# EAGLE schematic reeeflow-v3 (EAGLE 9.3.0)
CREVISION: 1.0; DESIGNER: Rafael Silva

## Sheet 1 of 4: Main Controller
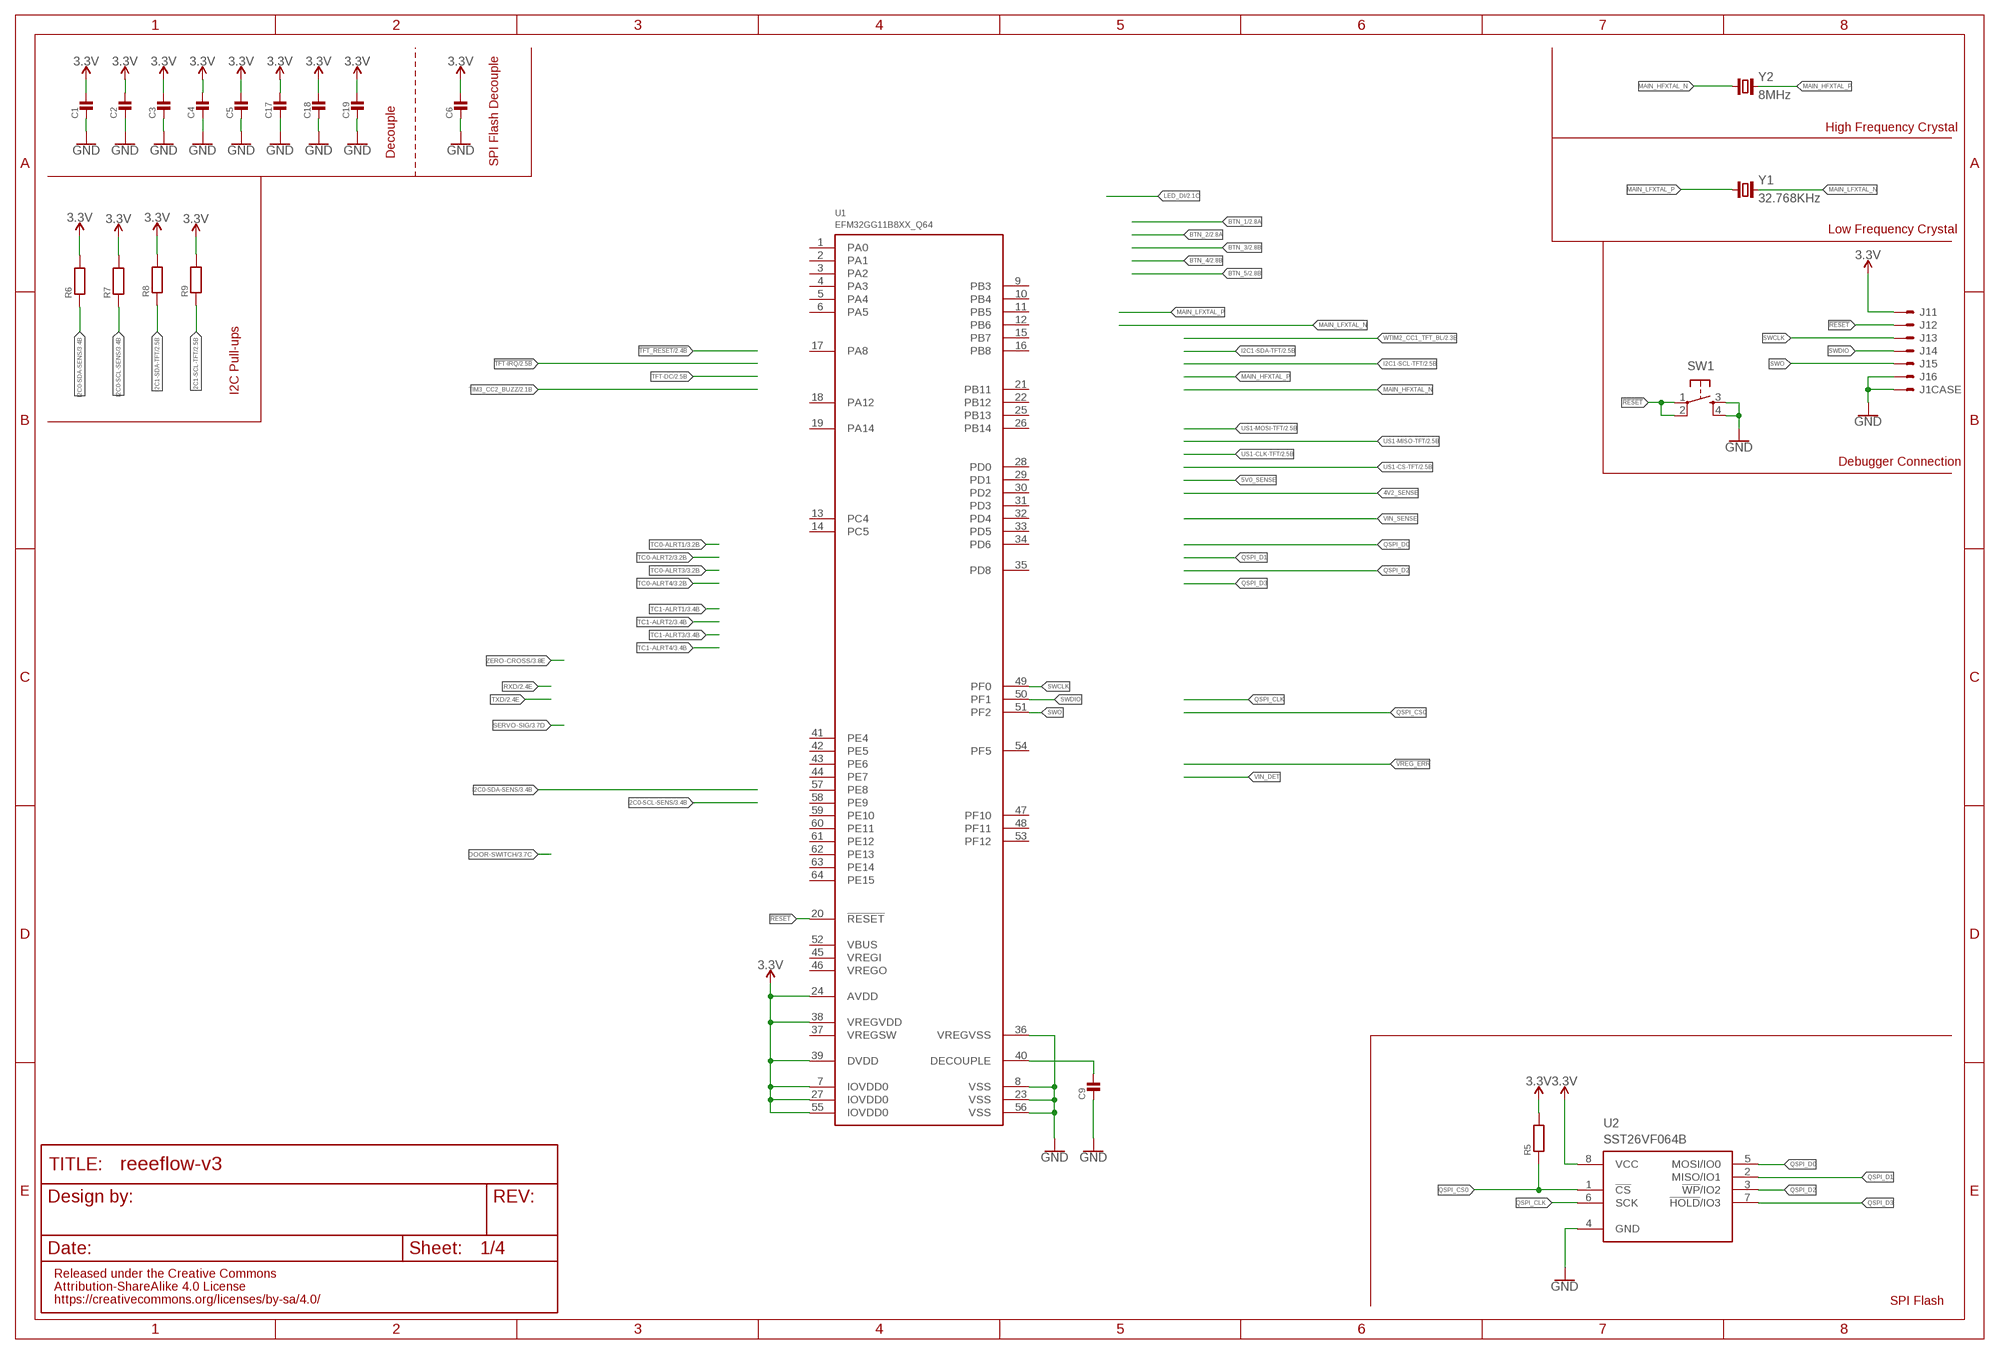
[diagram p0: schematic, sheet 1]

### Parts
C1  MLCC0603  [0603_WAVE]
C2  MLCC0603  [0603_WAVE]
C3  MLCC0603  [0603_WAVE]
C4  MLCC0603  [0603_WAVE]
C5  MLCC0603  [0603_WAVE]
C6  MLCC0603  [0603_WAVE]
C9  MLCC0603  [0603_WAVE]
C17  MLCC0603  [0603_WAVE]
C18  MLCC0603  [0603_WAVE]
C19  MLCC0603  [0603_WAVE]
J1  SH-6  [SM06B-SSR-H-TB]
R5  RESISTOR0603  [0603_WAVE]
R6  RESISTOR0603  [0603_WAVE]
R7  RESISTOR0603  [0603_WAVE]
R8  RESISTOR0603  [0603_WAVE]
R9  RESISTOR0603  [0603_WAVE]
SW1  PUSH_BUTTON  [PUSH_BUTTON]
U1  EFM32GG11B8XX_Q64  [QFP64]
U2  SST26VF064B  [WSOIC8]
Y1  32.768KHz  CRYSTALCM200S  [CM200S]
Y2  8MHz  CRYSTALNX5032GA  [2-SMD-5X3]

### Nets
3.3V: C1.P$1 C2.P$1 C3.P$1 C4.P$1 C5.P$1 C6.P$1 C17.P$1 C18.P$1 C19.P$1 J1.1 R5.P$2 R6.P$2 R7.P$2 R8.P$2 R9.P$2 U1.7(IOVDD0) U1.24(AVDD) U1.27(IOVDD0) U1.38(VREGVDD) U1.39(DVDD) U1.55(IOVDD0) U2.8(VCC) ; also sheet 2,3,4
!RESET: J1.2 SW1.1 SW1.2 U1.20(!RESET)
GND: C1.P$2 C2.P$2 C3.P$2 C4.P$2 C5.P$2 C6.P$2 C9.P$2 C17.P$2 C18.P$2 C19.P$2 J1.6 J1.FIT@1 J1.FIT@2 SW1.3 SW1.4 U1.8(VSS) U1.23(VSS) U1.36(VREGVSS) U1.56(VSS) U2.4(GND) ; also sheet 2,3,4
I2C0-SCL-SENS: R7.P$1 ; also sheet 3
I2C0-SDA-SENS: R6.P$1 ; also sheet 3
I2C1-SCL-TFT: R9.P$1 ; also sheet 2
I2C1-SDA-TFT: R8.P$1 ; also sheet 2
MAIN_HFXTAL_N: Y2.1
MAIN_HFXTAL_P: Y2.2
MAIN_LFXTAL_N: Y1.4
MAIN_LFXTAL_P: Y1.1
N$9: C9.P$1 U1.40(DECOUPLE)
QSPI_CLK: U2.6(SCK)
QSPI_CS0: R5.P$1 U2.1(!CS!)
QSPI_D0: U2.5(MOSI/IO0)
QSPI_D1: U2.2(MISO/IO1)
QSPI_D2: U2.3(!WP!/IO2)
QSPI_D3: U2.7(!HOLD!/IO3)
SWCLK: J1.3 U1.49(PF0)
SWDIO: J1.4 U1.50(PF1)
SWO: J1.5 U1.51(PF2)
Unconnected: U1.1(PA0) U1.2(PA1) U1.3(PA2) U1.4(PA3) U1.5(PA4) U1.6(PA5) U1.9(PB3) U1.10(PB4) U1.11(PB5) U1.12(PB6) U1.13(PC4) U1.14(PC5) U1.15(PB7) U1.16(PB8) U1.17(PA8) U1.18(PA12) U1.19(PA14) U1.21(PB11) U1.22(PB12) U1.25(PB13) U1.26(PB14) U1.28(PD0) U1.29(PD1) U1.30(PD2) U1.31(PD3) U1.32(PD4) U1.33(PD5) U1.34(PD6) U1.35(PD8) U1.37(VREGSW) U1.41(PE4) U1.42(PE5) U1.43(PE6) U1.44(PE7) U1.45(VREGI) U1.46(VREGO) U1.47(PF10) U1.48(PF11) U1.52(VBUS) U1.53(PF12) U1.54(PF5) U1.57(PE8) U1.58(PE9) U1.59(PE10) U1.60(PE11) U1.61(PE12) U1.62(PE13) U1.63(PE14) U1.64(PE15)

### Notes on the sheet
- High Frequency Crystal
- Decouple
- SPI Flash Decouple
- Low Frequency Crystal
- I2C Pull-ups
- Debugger Connection
- SPI Flash

## Sheet 2 of 4: User Interface
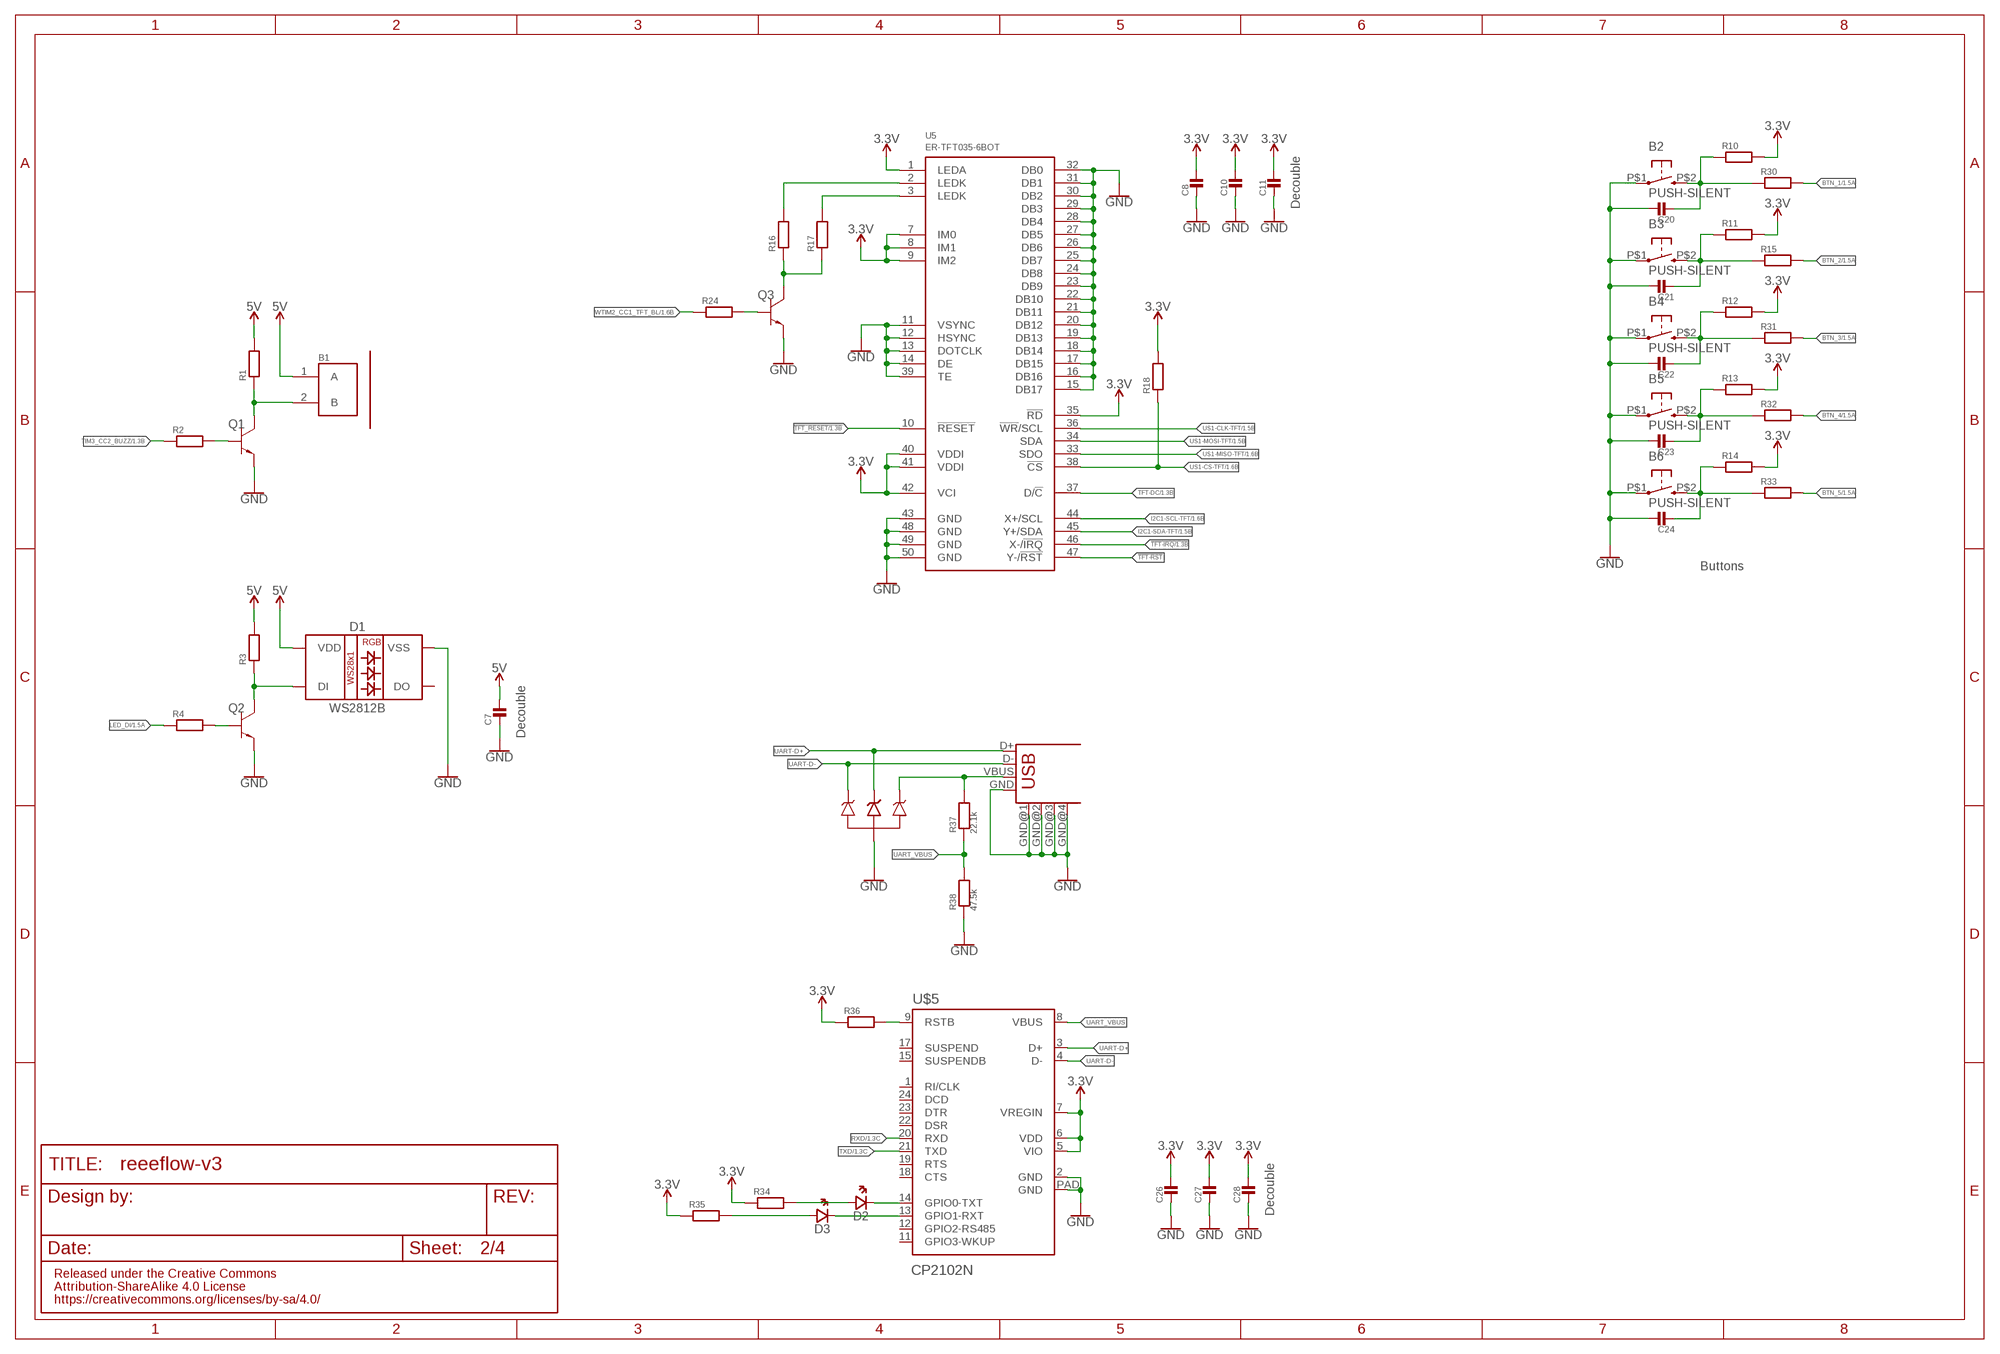
[diagram p1: schematic, sheet 2]

### Parts
B1  PKLCS1212E2400-R1  [BUZZ_PIEZO_SMD]
B2  PUSH-SILENT  [SILENT_BUT]
B3  PUSH-SILENT  [SILENT_BUT]
B4  PUSH-SILENT  [SILENT_BUT]
B5  PUSH-SILENT  [SILENT_BUT]
B6  PUSH-SILENT  [SILENT_BUT]
C7  MLCC0603  [0603_WAVE]
C8  MLCC0603  [0603_WAVE]
C10  MLCC0603  [0603_WAVE]
C11  MLCC0603  [0603_WAVE]
C20  MLCC0603  [0603_WAVE]
C21  MLCC0603  [0603_WAVE]
C22  MLCC0603  [0603_WAVE]
C23  MLCC0603  [0603_WAVE]
C24  MLCC0603  [0603_WAVE]
C26  MLCC0603  [0603_WAVE]
C27  MLCC0603  [0603_WAVE]
C28  MLCC0603  [0603_WAVE]
D1  WS2812B  [WS2812B]
D2  SML-D12  [0603_LED]
D3  SML-D12  [0603_LED]
D4  SP0503BAHT  [SOT143]
Q1  BC817-40  [SOT-23-3]
Q2  BC817-40  [SOT-23-3]
Q3  BC817-40  [SOT-23-3]
R1  RESISTOR0603  [0603_WAVE]
R2  RESISTOR0603  [0603_WAVE]
R3  RESISTOR0603  [0603_WAVE]
R4  RESISTOR0603  [0603_WAVE]
R10  RESISTOR0603  [0603_WAVE]
R11  RESISTOR0603  [0603_WAVE]
R12  RESISTOR0603  [0603_WAVE]
R13  RESISTOR0603  [0603_WAVE]
R14  RESISTOR0603  [0603_WAVE]
R15  RESISTOR0603  [0603_WAVE]
R16  RESISTOR0603  [0603_WAVE]
R17  RESISTOR0603  [0603_WAVE]
R18  RESISTOR0603  [0603_WAVE]
R24  RESISTOR0603  [0603_WAVE]
R30  RESISTOR0603  [0603_WAVE]
R31  RESISTOR0603  [0603_WAVE]
R32  RESISTOR0603  [0603_WAVE]
R33  RESISTOR0603  [0603_WAVE]
R34  RESISTOR0603  [0603_WAVE]
R35  RESISTOR0603  [0603_WAVE]
R36  RESISTOR0603  [0603_WAVE]
R37  22.1k  RESISTOR0603  [0603_WAVE]
R38  47.5k  RESISTOR0603  [0603_WAVE]
U5  ER-TFT035-6BOT  [ZIF50-TFT_BACK]
U$5  CP2102N  [QFN24]
U$6  USB-SHIELD  [USB-M-S1]

### Nets
3.3V: C8.P$1 C10.P$1 C11.P$1 C26.P$1 C27.P$1 C28.P$1 R10.P$2 R11.P$2 R12.P$2 R13.P$2 R14.P$2 R18.P$2 R34.P$1 R35.P$1 R36.P$1 U5.1(LEDA) U5.7(IM0) U5.8(IM1) U5.9(IM2) U5.35(!RD) U5.40(VDDI) U5.41(VDDI) U5.42(VCI) U$5.5(VIO) U$5.6(VDD) U$5.7(VREGIN) ; also sheet 1,3,4
5V: B1.1(A) C7.P$1 D1.1(VDD) R1.P$2 R3.P$2 ; also sheet 3,4
!TFT-IRQ: U5.46(X-/!IRQ!) ; also sheet 1
!TFT-RST: U5.47(Y-/!RST!)
!TFT_RESET: U5.10(!RESET) ; also sheet 1
BTN_1: R30.P$2 ; also sheet 1
BTN_2: R15.P$2 ; also sheet 1
BTN_3: R31.P$2 ; also sheet 1
BTN_4: R32.P$2 ; also sheet 1
BTN_5: R33.P$2 ; also sheet 1
GND: B2.P$1 B3.P$1 B4.P$1 B5.P$1 B6.P$1 C7.P$2 C8.P$2 C10.P$2 C11.P$2 C20.P$1 C21.P$1 C22.P$1 C23.P$1 C24.P$1 C26.P$2 C27.P$2 C28.P$2 D1.3(VSS) D4.1 Q1.P$2(EM2) Q2.P$2(EM2) Q3.P$2(EM2) R38.P$1 U5.11(VSYNC) U5.12(HSYNC) U5.13(DOTCLK) U5.14(DE) U5.15(DB17) U5.16(DB16) U5.17(DB15) U5.18(DB14) U5.19(DB13) U5.20(DB12) U5.21(DB11) U5.22(DB10) U5.23(DB9) U5.24(DB8) U5.25(DB7) U5.26(DB6) U5.27(DB5) U5.28(DB4) U5.29(DB3) U5.30(DB2) U5.31(DB1) U5.32(DB0) U5.39(TE) U5.43(GND) U5.48(GND) U5.49(GND) U5.50(GND) U$5.2(GND) U$5.PAD(GND) U$6.GND U$6.GND@1(GND) U$6.GND@2(GND) U$6.GND@3(GND) U$6.GND@4(GND) ; also sheet 1,3,4
I2C1-SCL-TFT: U5.44(X+/SCL) ; also sheet 1
I2C1-SDA-TFT: U5.45(Y+/SDA) ; also sheet 1
LED_DI: R4.P$1 ; also sheet 1
N$3: B2.P$2 C20.P$2 R10.P$1 R30.P$1
N$4: D4.4 R37.P$2 U$6.VBUS
N$6: B3.P$2 C21.P$2 R11.P$1 R15.P$1
N$8: B4.P$2 C22.P$2 R12.P$1 R31.P$1
N$10: Q2.P$1(BA1) R4.P$2
N$11: D1.4(DI) Q2.P$3(C03) R3.P$1
N$12: B5.P$2 C23.P$2 R13.P$1 R32.P$1
N$13: D3.P$1(CA) U$5.13(GPIO1-RXT)
N$14: B6.P$2 C24.P$2 R14.P$1 R33.P$1
N$15: D2.P$1(CA) U$5.14(GPIO0-TXT)
N$16: D2.P$2(AN) R34.P$2
N$17: B1.2(B) Q1.P$3(C03) R1.P$1
N$18: Q1.P$1(BA1) R2.P$2
N$19: D3.P$2(AN) R35.P$2
N$22: R16.P$2 U5.2(LEDK)
N$23: R17.P$2 U5.3(LEDK)
N$24: Q3.P$3(C03) R16.P$1 R17.P$1
N$25: Q3.P$1(BA1) R24.P$2
N$28: R36.P$2 U$5.9(RSTB)
RXD: U$5.20(RXD) ; also sheet 1
TFT-DC: U5.37(D/!C!) ; also sheet 1
TIM3_CC2_BUZZ: R2.P$1 ; also sheet 1
TXD: U$5.21(TXD) ; also sheet 1
UART-D+: D4.3 U$5.3(D+) U$6.D+
UART-D-: D4.2 U$5.4(D-) U$6.D-
UART_VBUS: R37.P$1 R38.P$2 U$5.8(VBUS)
US1-CLK-TFT: U5.36(!WR!/SCL) ; also sheet 1
US1-CS-TFT: R18.P$1 U5.38(!CS) ; also sheet 1
US1-MISO-TFT: U5.33(SDO) ; also sheet 1
US1-MOSI-TFT: U5.34(SDA) ; also sheet 1
WTIM2_CC1_TFT_BL: R24.P$1 ; also sheet 1
Unconnected: D1.2(DO) U$5.1(RI/CLK) U$5.11(GPIO3-WKUP) U$5.12(GPIO2-RS485) U$5.15(SUSPENDB) U$5.17(SUSPEND) U$5.18(CTS) U$5.19(RTS) U$5.22(DSR) U$5.23(DTR) U$5.24(DCD)

### Notes on the sheet
- Decouble
- Buttons
- Decouble
- Decouble

## Sheet 3 of 4: Feedback and Control
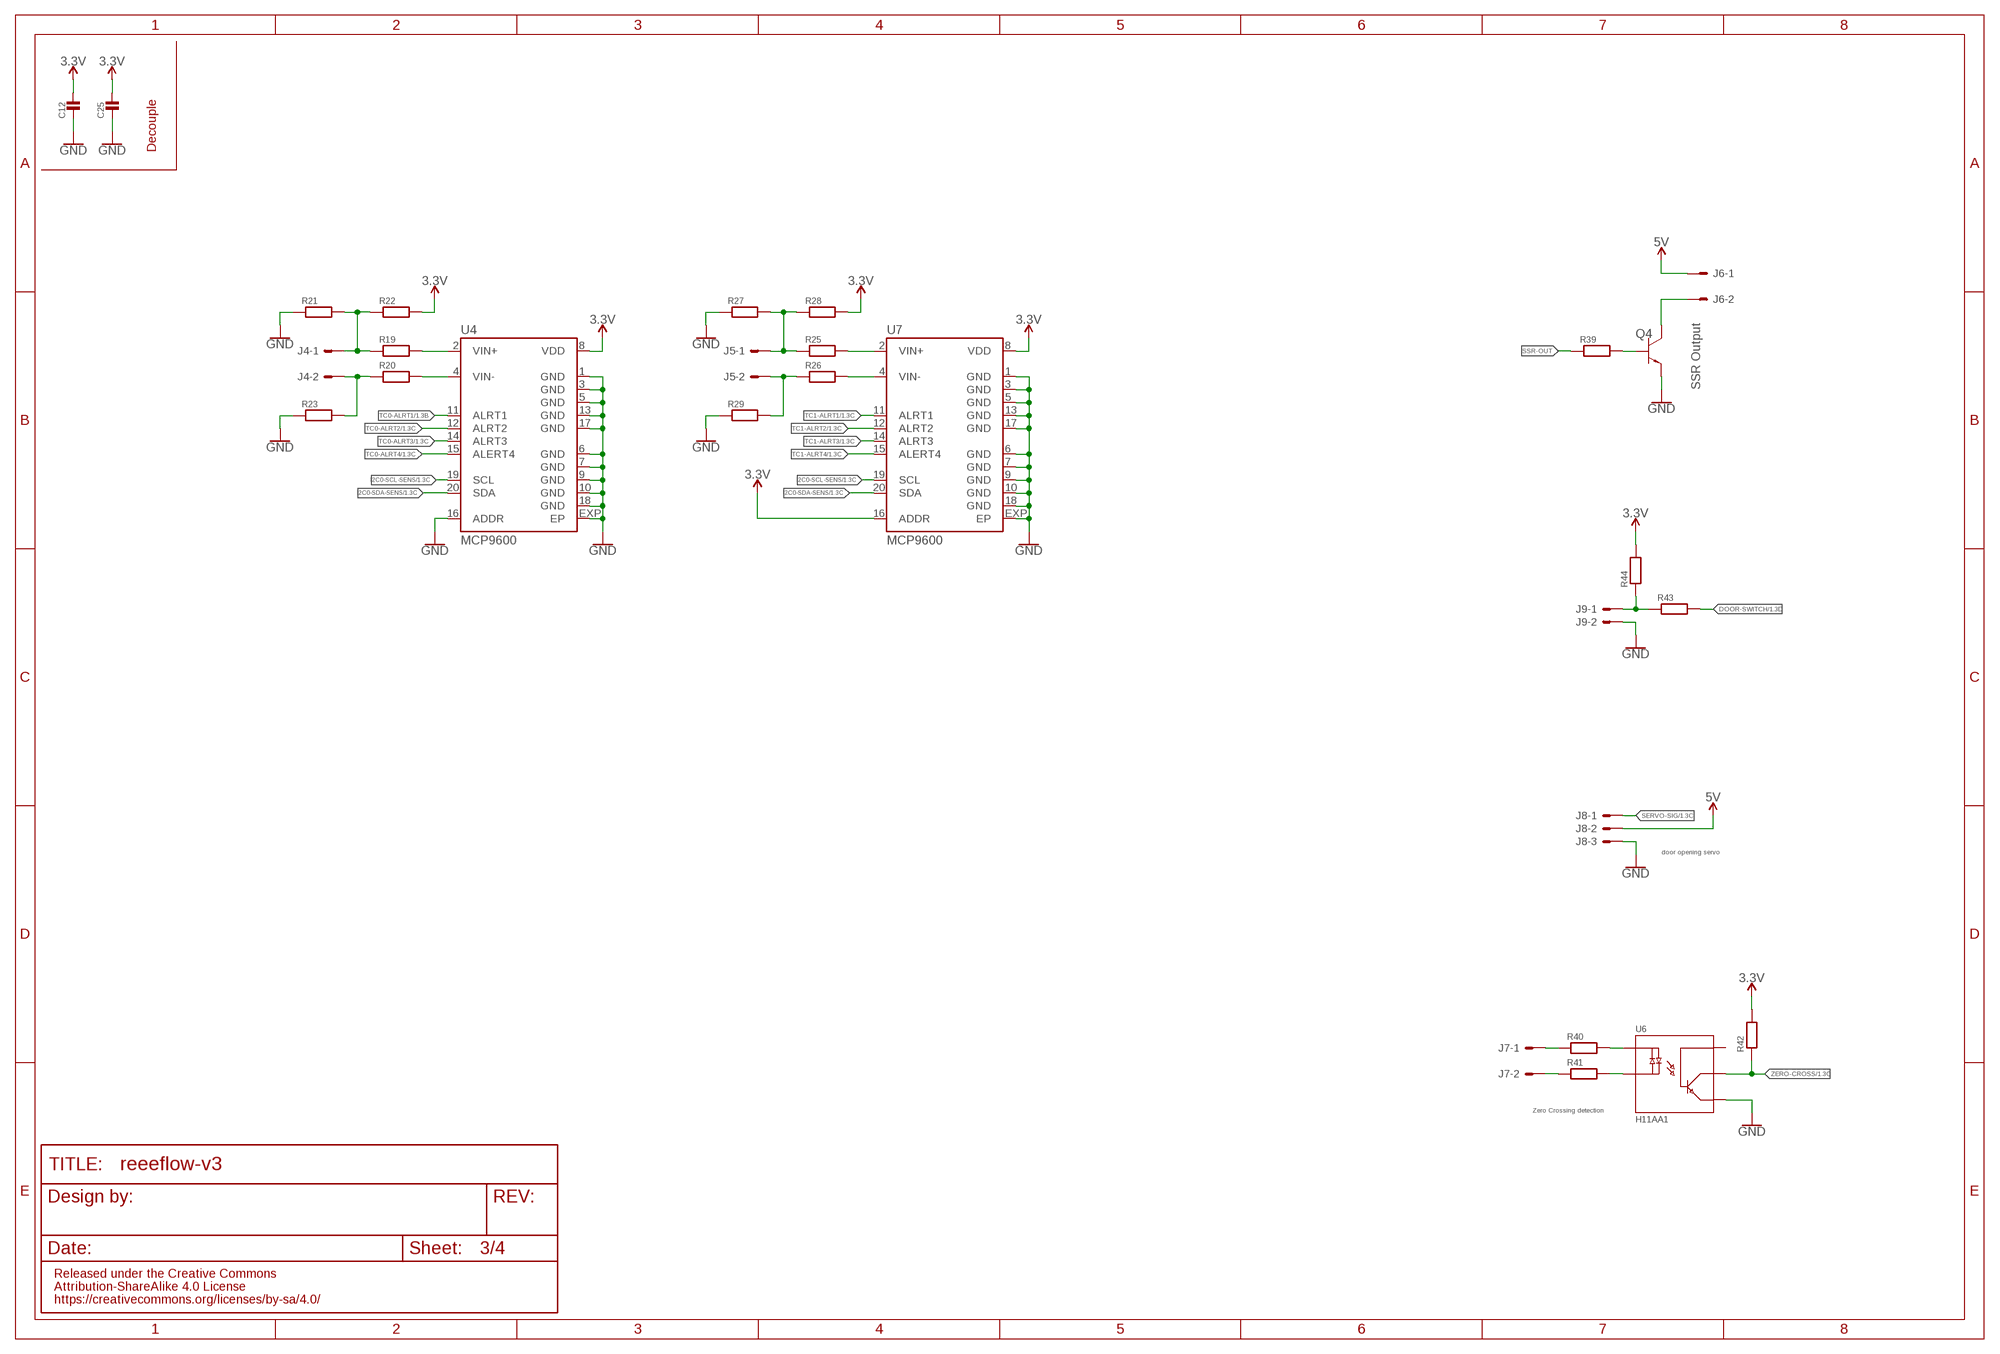
[diagram p2: schematic, sheet 3]

### Parts
C12  MLCC0603  [0603_WAVE]
C25  MLCC0603  [0603_WAVE]
J4  2EDG-2P  [2EDG-2P]
J5  2EDG-2P  [2EDG-2P]
J6  2EDG-2P  [2EDG-2P]
J7  2EDG-2P  [2EDG-2P]
J8  3X1_2.54  [3X1_2.54]
J9  2X1_2.54  [2X1_2.54]
Q4  BC817-40  [SOT-23-3]
R19  RESISTOR0603  [0603_WAVE]
R20  RESISTOR0603  [0603_WAVE]
R21  RESISTOR0603  [0603_WAVE]
R22  RESISTOR0603  [0603_WAVE]
R23  RESISTOR0603  [0603_WAVE]
R25  RESISTOR0603  [0603_WAVE]
R26  RESISTOR0603  [0603_WAVE]
R27  RESISTOR0603  [0603_WAVE]
R28  RESISTOR0603  [0603_WAVE]
R29  RESISTOR0603  [0603_WAVE]
R39  RESISTOR0603  [0603_WAVE]
R40  RESISTOR0603  [0603_WAVE]
R41  RESISTOR0603  [0603_WAVE]
R42  RESISTOR0603  [0603_WAVE]
R43  RESISTOR0603  [0603_WAVE]
R44  RESISTOR0603  [0603_WAVE]
U4  MCP9600  [TQFN20-5X5]
U6  H11AA1  [DIP-6-SMD]
U7  MCP9600  [TQFN20-5X5]

### Nets
3.3V: C12.P$1 C25.P$1 R22.P$2 R28.P$2 R42.P$2 R44.P$2 U4.8(VDD) U7.8(VDD) U7.16(ADDR) ; also sheet 1,2,4
5V: J6.P$1 J8.P$2 ; also sheet 2,4
DOOR-SWITCH: R43.P$2 ; also sheet 1
GND: C12.P$2 C25.P$2 J8.P$3 Q4.P$2(EM2) R21.P$1 R23.P$1 R27.P$1 R29.P$1 U4.1(GND) U4.3(GND) U4.5(GND) U4.6(GND) U4.7(GND) U4.9(GND) U4.10(GND) U4.13(GND) U4.16(ADDR) U4.17(GND) U4.18(GND) U4.EXP(EP) U6.P$4(E) U7.1(GND) U7.3(GND) U7.5(GND) U7.6(GND) U7.7(GND) U7.9(GND) U7.10(GND) U7.13(GND) U7.17(GND) U7.18(GND) U7.EXP(EP) ; also sheet 1,2,4
I2C0-SCL-SENS: U4.19(SCL) U7.19(SCL) ; also sheet 1
I2C0-SDA-SENS: U4.20(SDA) U7.20(SDA) ; also sheet 1
N$1: R25.P$2 U7.2(VIN+)
N$2: R26.P$2 U7.4(VIN-)
N$5: Q4.P$1(BA1) R39.P$2
N$7: J6.P$2 Q4.P$3(C03)
N$20: J7.P$1 R40.P$1
N$21: R40.P$2 U6.P$1(AC)
N$26: R19.P$2 U4.2(VIN+)
N$27: R20.P$2 U4.4(VIN-)
N$29: R41.P$2 U6.P$2(CA)
N$30: J7.P$2 R41.P$1
N$32: J9.2 ; supply symbol labelled GND
N$33: J9.1 R43.P$1 R44.P$1
SERVO-SIG: J8.P$1 ; also sheet 1
SSR-OUT: R39.P$1
TC0-ALRT1: U4.11(ALRT1) ; also sheet 1
TC0-ALRT2: U4.12(ALRT2) ; also sheet 1
TC0-ALRT3: U4.14(ALRT3) ; also sheet 1
TC0-ALRT4: U4.15(ALERT4) ; also sheet 1
TC1-ALRT1: U7.11(ALRT1) ; also sheet 1
TC1-ALRT2: U7.12(ALRT2) ; also sheet 1
TC1-ALRT3: U7.14(ALRT3) ; also sheet 1
TC1-ALRT4: U7.15(ALERT4) ; also sheet 1
TC_VIN0+: J4.P$1 R19.P$1 R21.P$2 R22.P$1
TC_VIN0-: J4.P$2 R20.P$1 R23.P$2
TC_VIN1+: J5.P$1 R25.P$1 R27.P$2 R28.P$1
TC_VIN1-: J5.P$2 R26.P$1 R29.P$2
ZERO-CROSS: R42.P$1 U6.P$5(C) ; also sheet 1
Unconnected: U6.P$6(B)

### Notes on the sheet
- Decouple
- SSR Output
- door opening servo
- Zero Crossing detection

## Sheet 4 of 4: Power
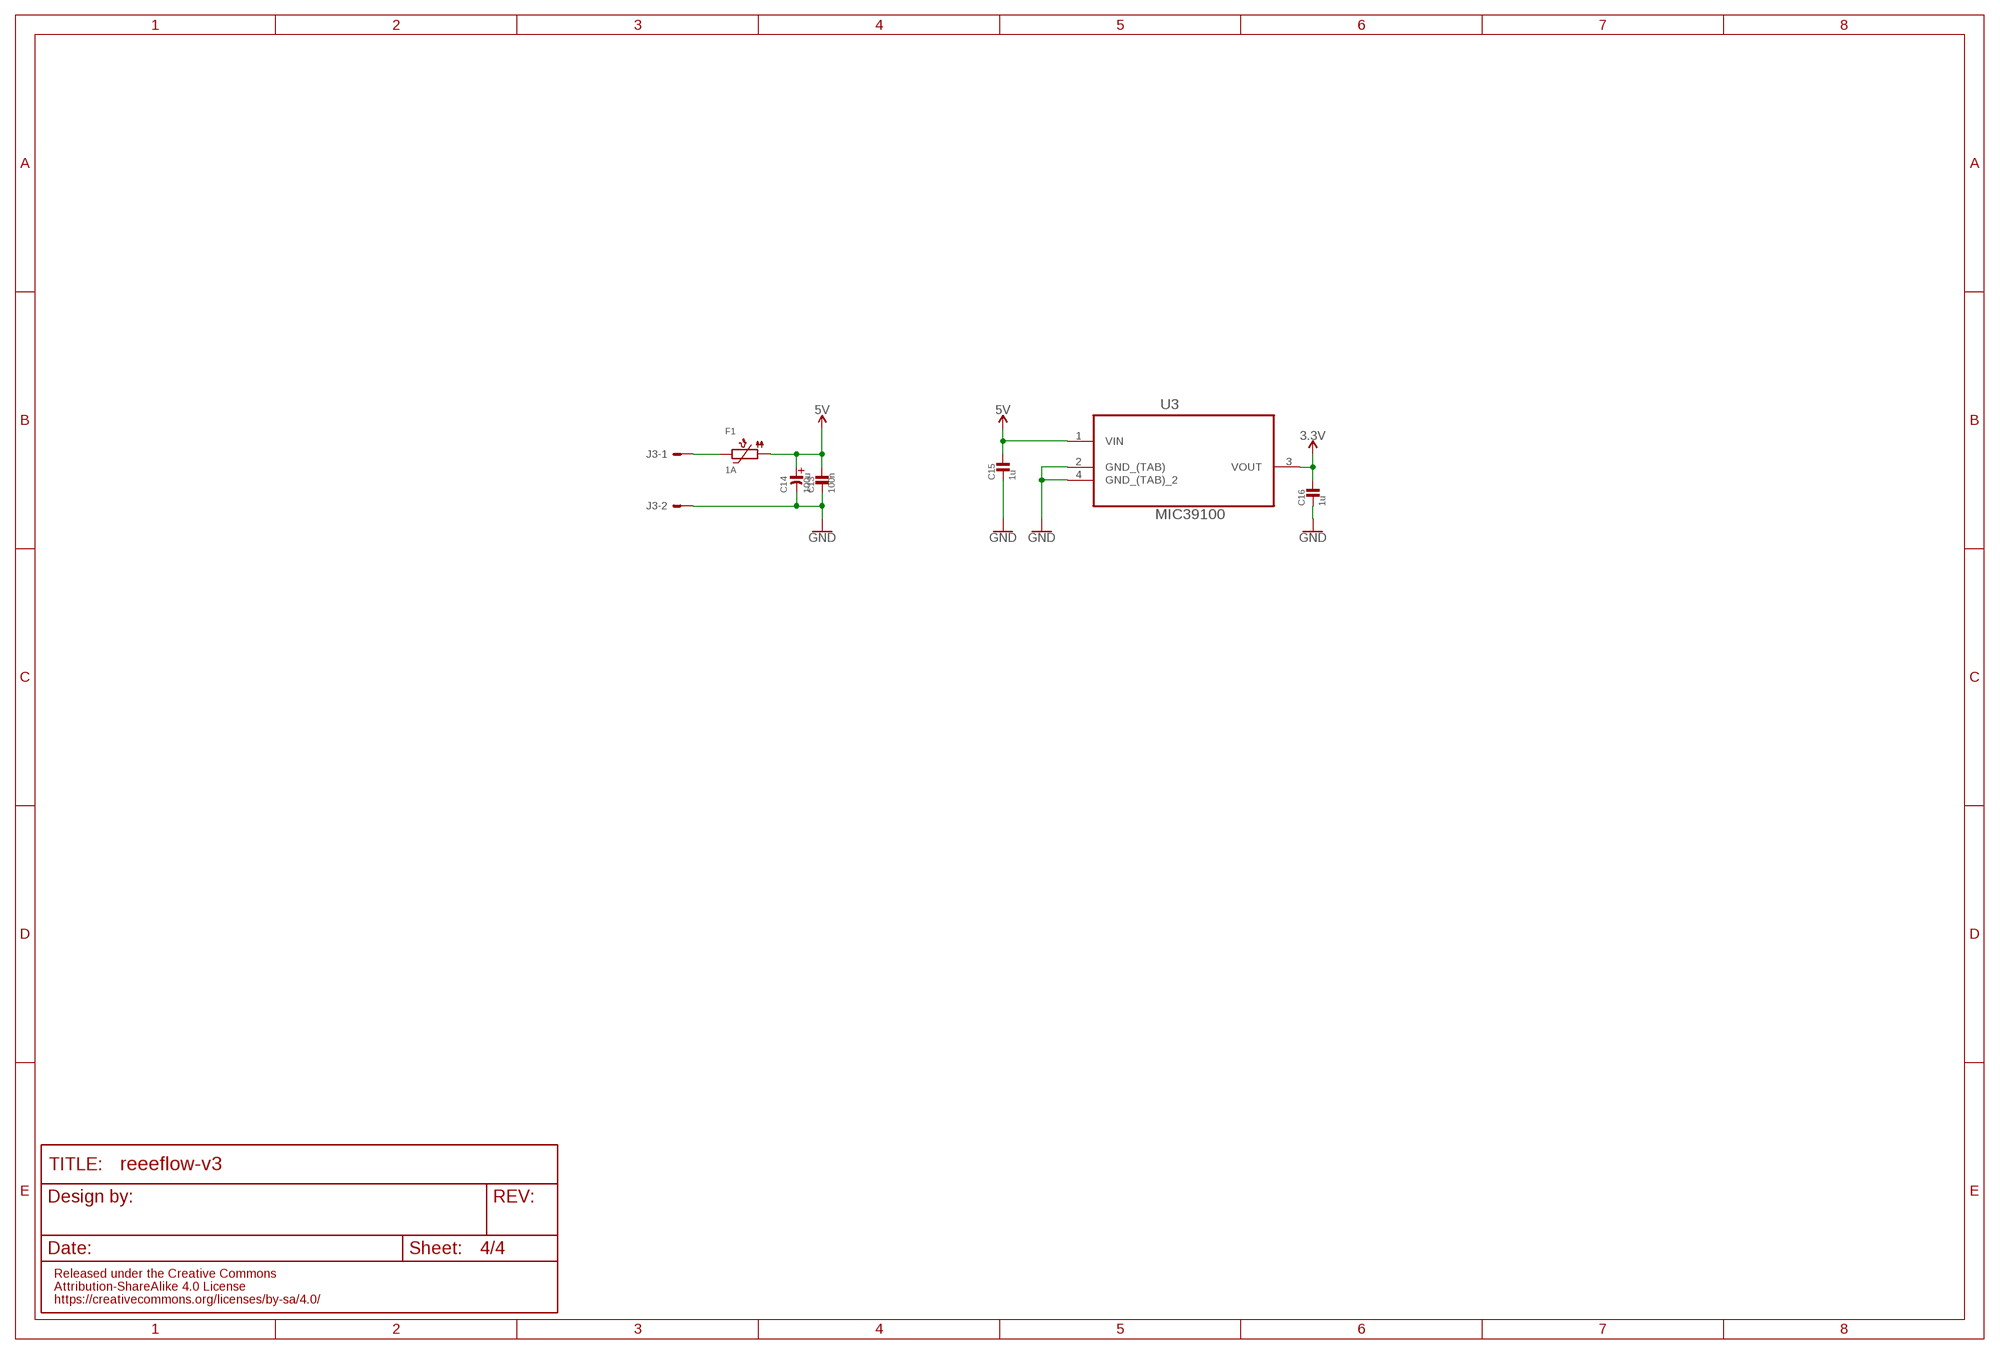
[diagram p3: schematic, sheet 4]

### Parts
C13  100n  MLCC0603  [0603_WAVE]
C14  100u  CAPACITOR_EL10X10  [10X10-EL]
C15  1u  MLCC0603  [0603_WAVE]
C16  1u  MLCC0603  [0603_WAVE]
F1  1A  PTC1812  [PTC1812]
J3  2EDG-2P  [2EDG-2P]
U3  MIC39100  [SOT230P700X180-4N]

### Nets
3.3V: C16.P$1 U3.3(VOUT) ; also sheet 1,2,3
5V: C13.P$1 C14.AN C15.P$1 F1.P$1 U3.1(VIN) ; also sheet 2,3
GND: C13.P$2 C14.CAT(CA) C15.P$2 C16.P$2 J3.P$2 U3.2(GND_(TAB)) U3.4(GND_(TAB)_2) ; also sheet 1,2,3
N$31: F1.P$2 J3.P$1

## Library data of the parts
B1 = Eletromechanical > Buzzer:PKLCS1212E2400-R1
B2-B6 = Eletromechanical > Switches > Tactile Switches:PUSH-SILENT
C1-C13 C15-C28 = Passive Components > Capacitors > Multilayer Ceramic Capacitors MLCC:MLCC: KEMET’s X7R dielectric features a 125°C maximum operating temperature and is considered temperature stable. The Electronics Components, Assemblies and Materials Association (EIA) characterizes X7R dielectric as a Class II material. Components of this classification are fixed, ceramic dielectric capacitors suited for bypass and decoupling applications or for frequency discriminating circuits where Q and stability of capacitance characteristics are not critical. X7R exhibits a predictable change in capacitance with respect to time and voltage, boasting a minimal change in capacitance with reference to ambient temperature. Capacitance change is limited to ±15% from −55°C to +125°C.
C14 = Passive Components > Capacitors > Aluminium Electrolytic Capacitors:CAPACITOR_EL
D1 = Opto-electronics > LED Emitters:WS2812B: WS2812B SMD addressable RGB LED 5x5mm SMD LED with built-in controller IC. Color: Red/Green/Blue mC Rating: RGB: 390, 660, 180 mcd Forward Voltage: RGB: 2.0, 3.0, 3.0 V Packages:WS2812B SparkFun Products: Blynk Board - ESP8266 <https://www.sparkfun.com/products/13794>; PROD_ID: DIO-12503
D2 D3 = Opto-electronics > LED Emitters:SML-D12
D4 = Circuit Protection > ESD Suppressors \ TVS Diodes:SP0503BAHT
F1 = Circuit Protection > Resettable Fuses - PPTC:PTC
J1 = Connectors > JST > SH:SH-6
J3-J7 = Connectors > Other:2EDG-2P
J8 = Connectors > Header:3X1_2.54
J9 = Connectors > Header:2X1_2.54
Q1-Q4 = Semiconductors > Discrete Semiconductors > Transistors > Bipolar Transistors - BJT:BC817-40
R1-R44 = Passive Components > Resistors > Chip Resistors:RESISTOR: Resistors For new designs, use the packages preceded by an '_' character since they are more reliable: The following footprints should be used on most boards: _0402 - Standard footprint for regular board layouts _0603 - Standard footprint for regular board layouts _0805 - Standard footprint for regular board layouts _1206 - Standard footprint for regular board layouts For extremely tight-pitch boards where space is at a premium, the following 'micro-pitch' footprints can be used (smaller pads, no silkscreen outline, etc.): _0402MP - Micro-pitch footprint for very dense/compact boards _0603MP - Micro-pitch footprint for very dense/compact boards _0805MP - Micro-pitch footprint for very dense/compact boards _1206MP - Micro-pitch footprint for very dense/compact boards
SW1 = Eletromechanical > Switches > Tactile Switches:PUSH_BUTTON
U1 = Semiconductors > Embedded Processors & Controllers > Microcontrollers - MCU:EFM32GG11B8XX_Q64
U2 = Semiconductors > Integrated Circuits - ICs > Memory ICs > Flash:SST26VF064B
U3 = Power > LDO Voltage Regulators:MIC39100: IC, LDO VOLT REG, 3.3V, 0.3A,; MPN: MCP1824ST-3302E/DB; OC_FARNELL: 1578379; OC_NEWARK: 05N1293; PACKAGE: SOT-223-3; SUPPLIER: Microchip
U4 U7 = Sensors > Temperature Sensors:MCP9600
U5 = Opto-electronics > Displays:ER-TFT035-6
U6 = Opto-electronics > Optocouplers\Photocouplers:H11AA1
U$5 = Semiconductors > Integrated Circuits - ICs > Interface ICs > USB Interface IC:CP2102N
U$6 = Connectors > USB:USB-SHIELD
Y1 Y2 = Passive Components > Frequency Control & Timing Devices > Crystals:CRYSTAL: Citizen CM200S & CM250S Series